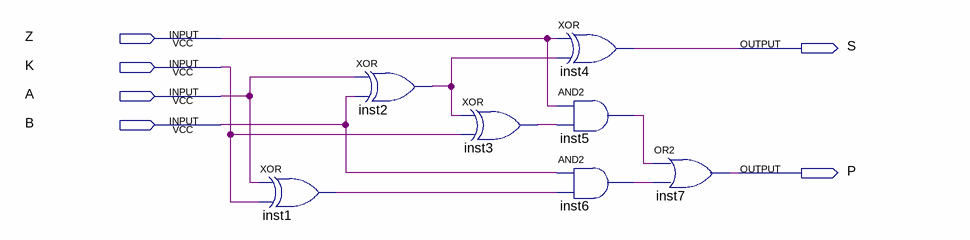
[diagram p0: schematic sheet]
// Quartus schematic adder.bdf as structural Verilog: 7 symbols, 6 pins
module adder (
  input  Z,
  input  K,
  input  A,
  input  B,
  output S,
  output P
);

  wire inst1_out, inst2_out, inst3_out, inst5_out, inst6_out;

  xor inst1 (inst1_out, A, K);
  xor inst2 (inst2_out, A, B);
  xor inst3 (inst3_out, inst2_out, K);
  xor inst4 (S, Z, inst2_out);
  and inst5 (inst5_out, Z, inst3_out);
  and inst6 (inst6_out, B, inst1_out);
  or inst7 (P, inst5_out, inst6_out);
endmodule
